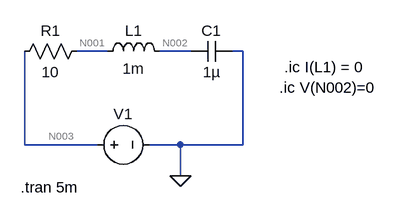
[diagram p0: schematic lcr.asc]
lcr.asc, the LTspice schematic file:
Version 4
SHEET 1 880 680
WIRE 144 144 96 144
WIRE 272 144 224 144
WIRE 352 144 336 144
WIRE 16 288 16 144
WIRE 128 288 16 288
WIRE 256 288 208 288
WIRE 352 288 352 144
WIRE 352 288 256 288
WIRE 256 336 256 288
FLAG 256 336 0
SYMBOL ind 128 160 R270
WINDOW 0 32 56 VTop 2
WINDOW 3 5 56 VBottom 2
SYMATTR InstName L1
SYMATTR Value 1m
SYMBOL cap 336 128 R90
WINDOW 0 0 32 VBottom 2
WINDOW 3 32 32 VTop 2
SYMATTR InstName C1
SYMATTR Value 1µ
SYMBOL res 112 128 R90
WINDOW 0 0 56 VBottom 2
WINDOW 3 32 56 VTop 2
SYMATTR InstName R1
SYMATTR Value 10
SYMBOL voltage 112 288 R270
WINDOW 0 32 56 VTop 2
WINDOW 3 -32 56 Invisible 2
WINDOW 123 0 0 Left 2
WINDOW 39 0 0 Left 2
SYMATTR InstName V1
SYMATTR Value PWL(0 10 2m 10 3m 10 3.0001m 0)
TEXT 408 200 Left 2 !.ic V(N002)=0
TEXT 416 168 Left 2 !.ic I(L1) = 0
TEXT 10 354 Left 2 !.tran 5m

The netlist it stands for:
* lcr.asc
L1 N001 N002 1m
C1 0 N002 1µ
R1 N001 N003 10
V1 N003 0 PWL(0 10 2m 10 3m 10 3.0001m 0)
.ic V(N002)=0
.ic I(L1) = 0
.tran 5m
.backanno
.end

* Results of the author's LTspice run, read from the files saved beside the schematic
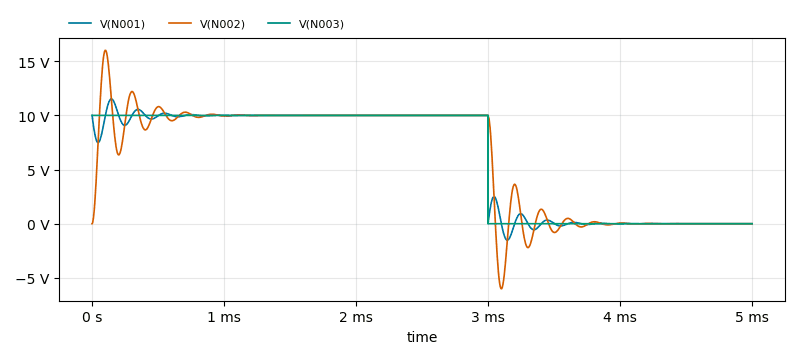
[diagram p1: Transient Analysis of lcr.asc, plotted from the saved traces]
* Transient Analysis, 1 run:
*   V(N001): min -1.52 V, max 11.52 V, average 6 V, rms 7.733 V, last -73.02 µV
*   V(N002): min -6.01 V, max 16.01 V, average 6 V, rms 7.861 V, last 386.3 µV
*   V(N003): min 0 V, max 10 V, average 6 V, rms 7.746 V, last 0 V